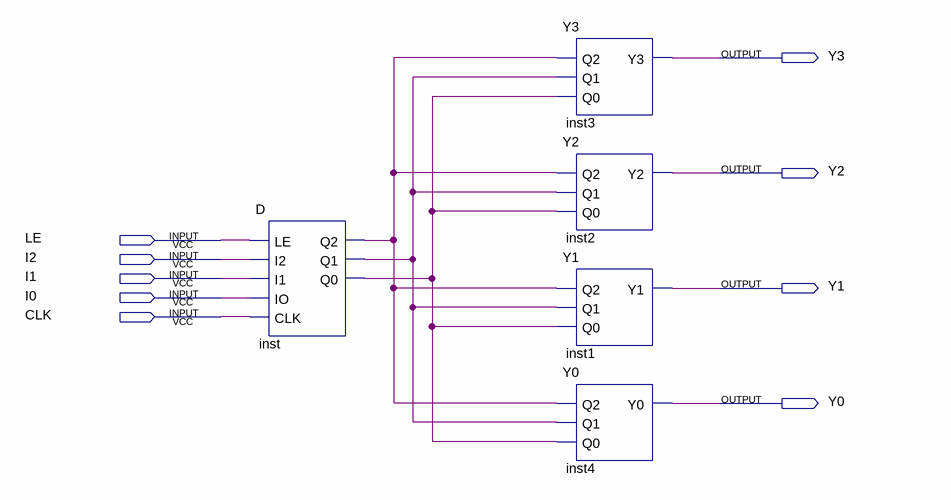
[diagram p0: schematic sheet]
// Quartus schematic Lab1_22521219.bdf as structural Verilog: 5 symbols, 9 pins
module Lab1_22521219 (
  input  LE,
  input  I2,
  input  I1,
  input  I0,
  input  CLK,
  output Y3,
  output Y2,
  output Y1,
  output Y0
);

  wire inst_q0, inst_q1, inst_q2;

  D inst (.LE(LE), .I2(I2), .I1(I1), .IO(I0), .CLK(CLK), .Q2(inst_q2), .Q1(inst_q1), .Q0(inst_q0));
  Y3 inst3 (.Q2(inst_q2), .Q1(inst_q1), .Q0(inst_q0), .Y3(Y3));
  Y2 inst2 (.Q2(inst_q2), .Q1(inst_q1), .Q0(inst_q0), .Y2(Y2));
  Y1 inst1 (.Q2(inst_q2), .Q1(inst_q1), .Q0(inst_q0), .Y1(Y1));
  Y0 inst4 (.Q2(inst_q2), .Q1(inst_q1), .Q0(inst_q0), .Y0(Y0));
endmodule
